# Altium schematic sheet THE_FIRST.SchDoc
size 558 x 431 mm; DocumentNumber: 1; SheetNumber: 1; SheetTotal: 9
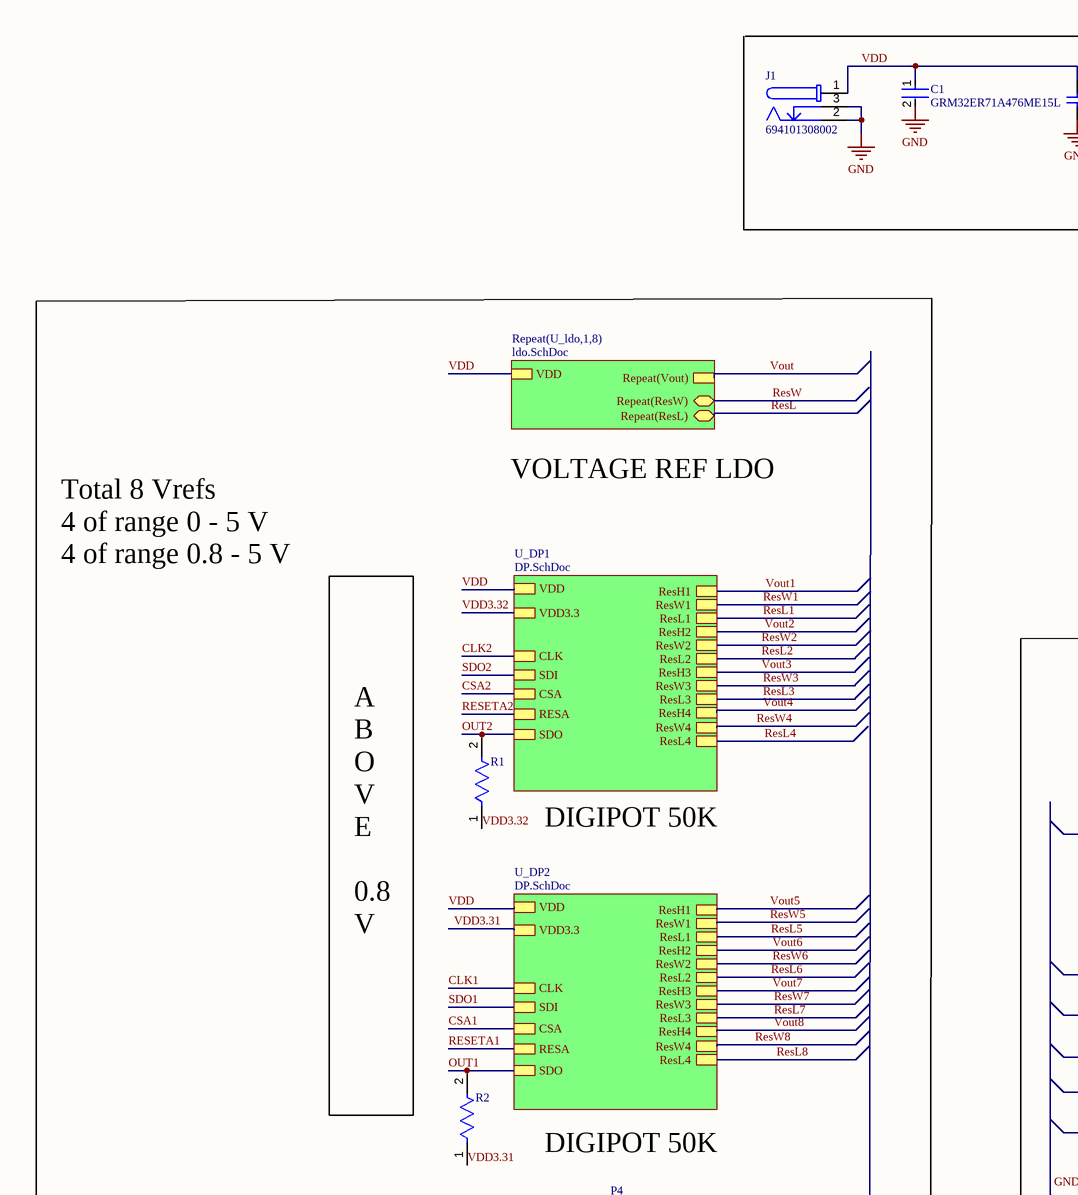
[diagram p0: THE_FIRST.SchDoc, top left]
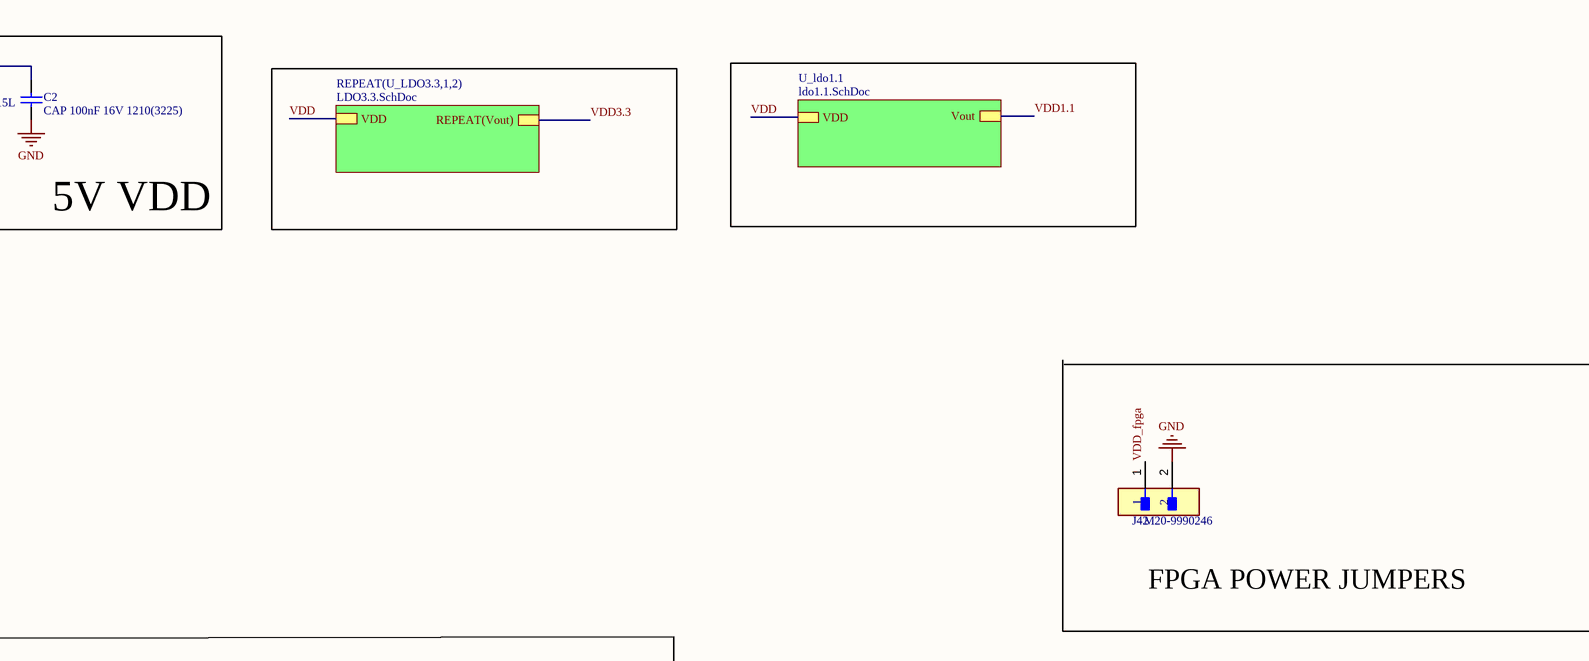
[diagram p1: THE_FIRST.SchDoc, top right]
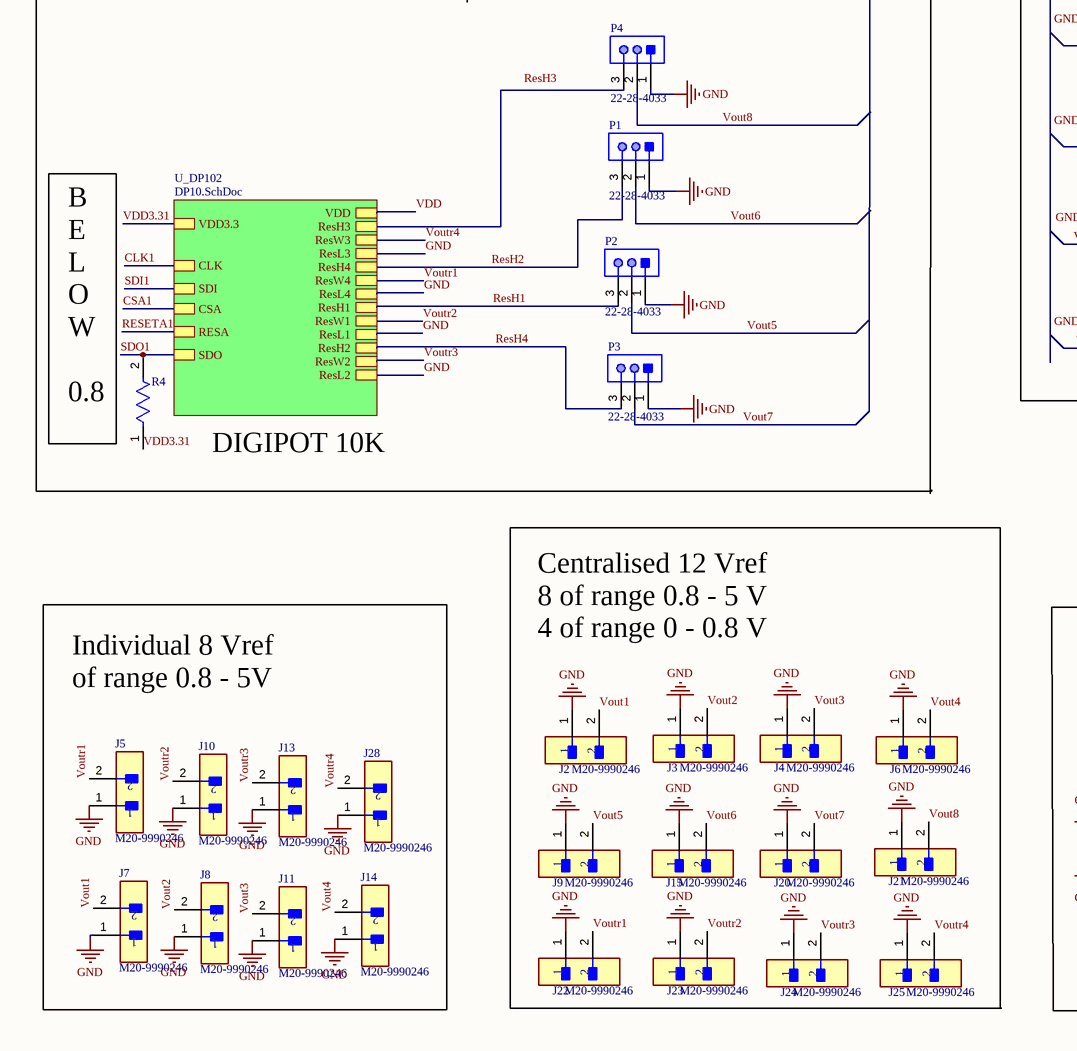
[diagram p2: THE_FIRST.SchDoc, bottom left]
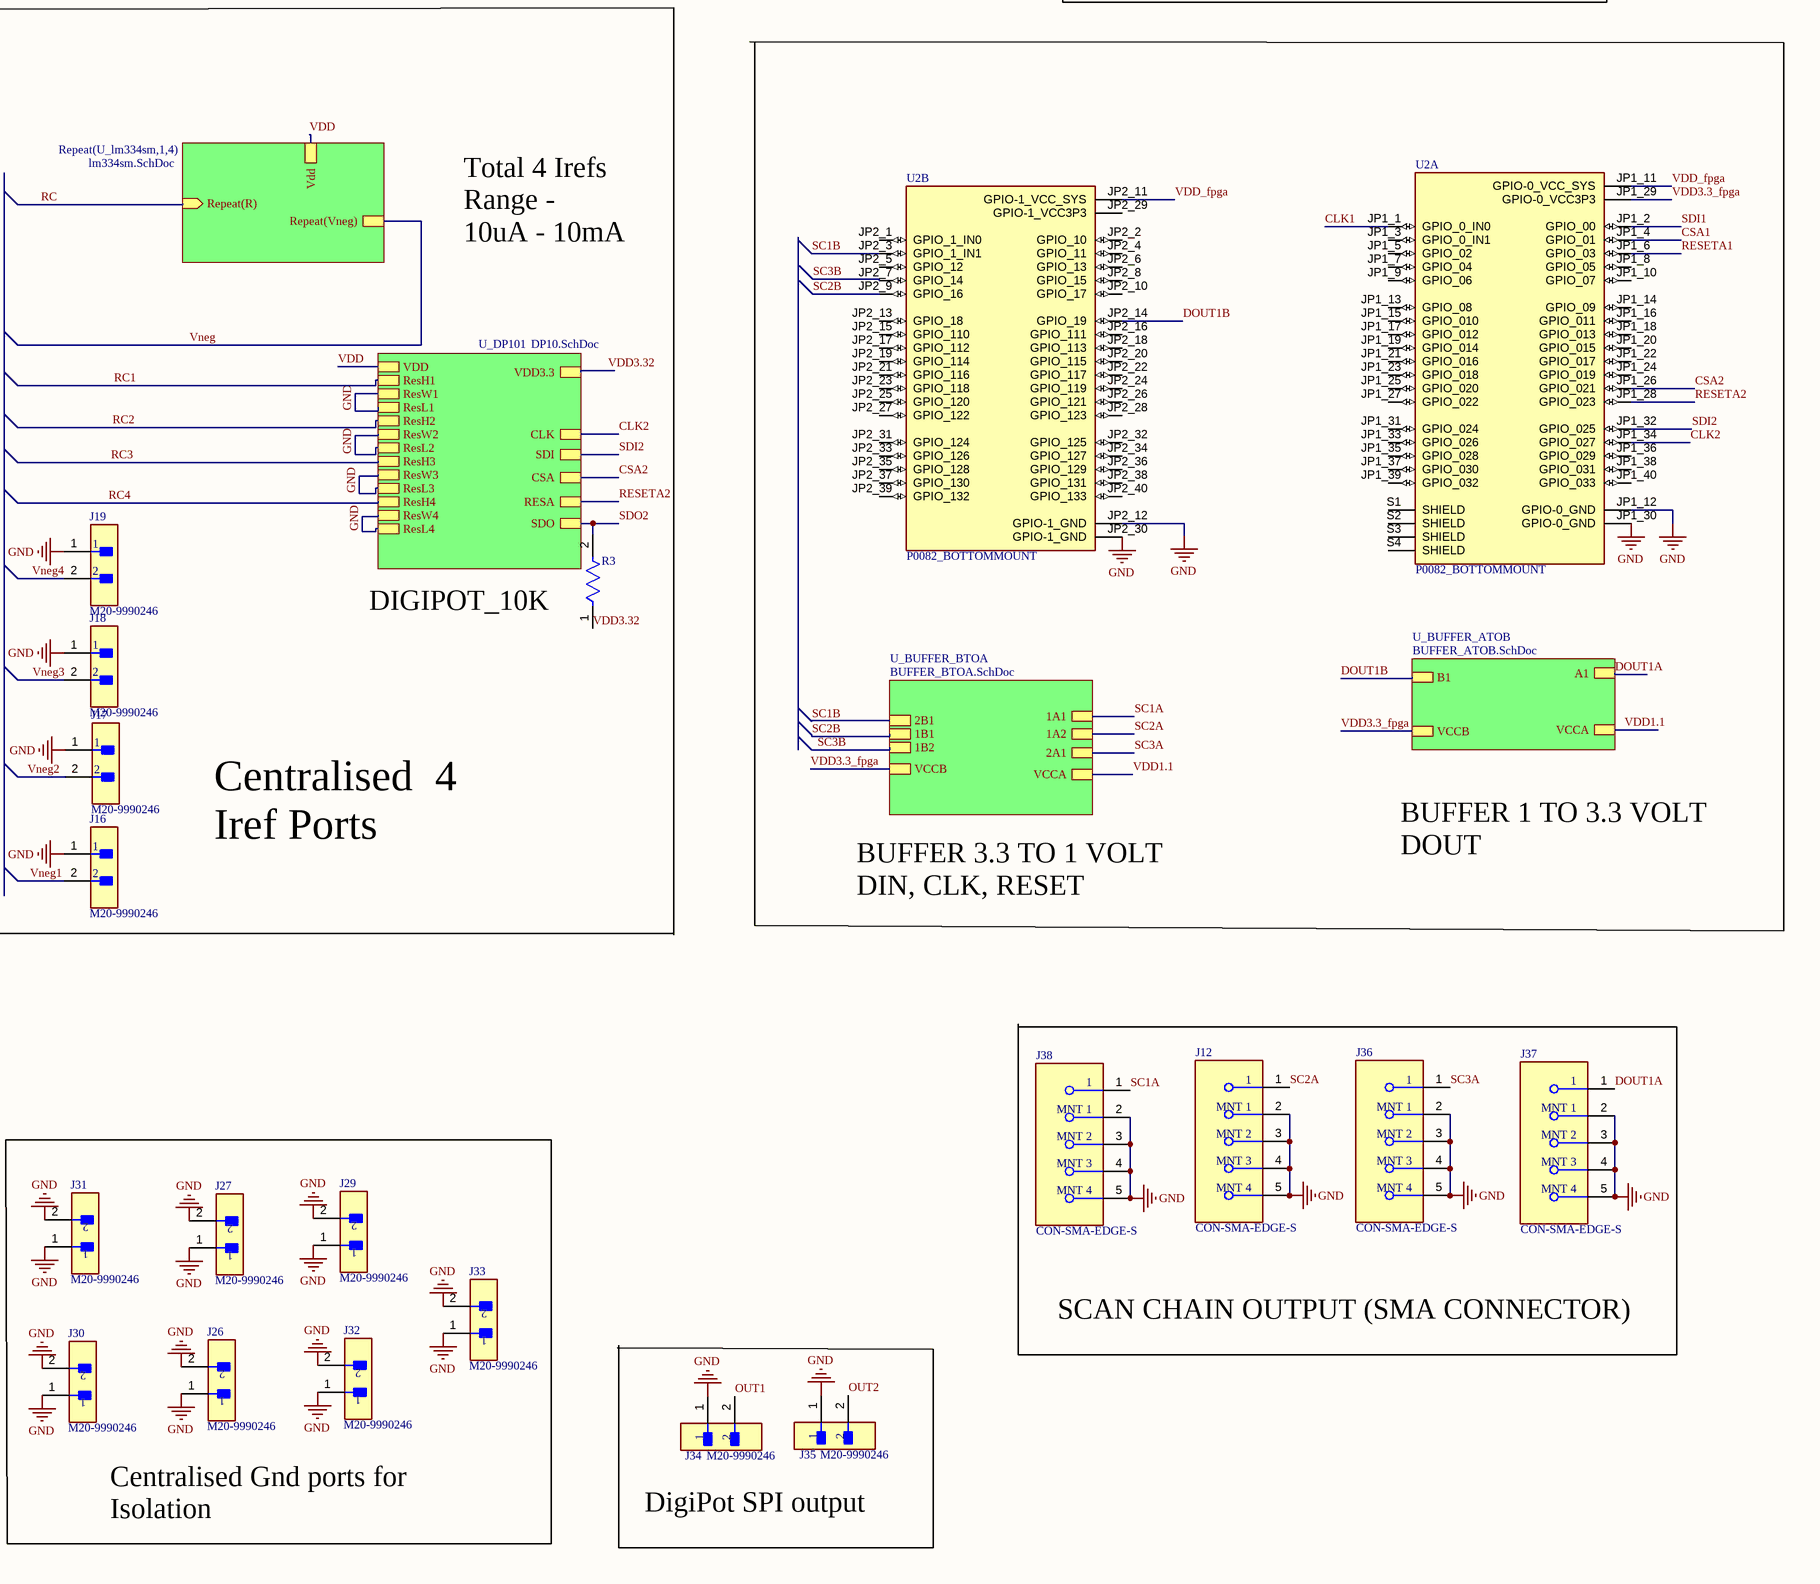
[diagram p3: THE_FIRST.SchDoc, bottom right]

## Parts
C1  GRM32ER71A476ME15L  [FP-GRM32E-0_3-0_2-IPC_A]
C2  CAP 100nF 16V 1210(3225)  [CAPC1210(3225)115_M]
J1  694101308002  [694101308002]
J2  M20-9990246  [FP-M20-9990246-MFG]
J3  M20-9990246  [FP-M20-9990246-MFG]
J4  M20-9990246  [FP-M20-9990246-MFG]
J5  M20-9990246  [FP-M20-9990246-MFG]
J6  M20-9990246  [FP-M20-9990246-MFG]
J7  M20-9990246  [FP-M20-9990246-MFG]
J8  M20-9990246  [FP-M20-9990246-MFG]
J9  M20-9990246  [FP-M20-9990246-MFG]
J10  M20-9990246  [FP-M20-9990246-MFG]
J11  M20-9990246  [FP-M20-9990246-MFG]
J12  CON-SMA-EDGE-S  [FP-CON-SMA-EDGE-S-MFG]
J13  M20-9990246  [FP-M20-9990246-MFG]
J14  M20-9990246  [FP-M20-9990246-MFG]
J15  M20-9990246  [FP-M20-9990246-MFG]
J16  M20-9990246  [FP-M20-9990246-MFG]
J17  M20-9990246  [FP-M20-9990246-MFG]
J18  M20-9990246  [FP-M20-9990246-MFG]
J19  M20-9990246  [FP-M20-9990246-MFG]
J20  M20-9990246  [FP-M20-9990246-MFG]
J21  M20-9990246  [FP-M20-9990246-MFG]
J22  M20-9990246  [FP-M20-9990246-MFG]
J23  M20-9990246  [FP-M20-9990246-MFG]
J24  M20-9990246  [FP-M20-9990246-MFG]
J25  M20-9990246  [FP-M20-9990246-MFG]
J26  M20-9990246  [FP-M20-9990246-MFG]
J27  M20-9990246  [FP-M20-9990246-MFG]
J28  M20-9990246  [FP-M20-9990246-MFG]
J29  M20-9990246  [FP-M20-9990246-MFG]
J30  M20-9990246  [FP-M20-9990246-MFG]
J31  M20-9990246  [FP-M20-9990246-MFG]
J32  M20-9990246  [FP-M20-9990246-MFG]
J33  M20-9990246  [FP-M20-9990246-MFG]
J34  M20-9990246  [FP-M20-9990246-MFG]
J35  M20-9990246  [FP-M20-9990246-MFG]
J36  CON-SMA-EDGE-S  [FP-CON-SMA-EDGE-S-MFG]
J37  CON-SMA-EDGE-S  [FP-CON-SMA-EDGE-S-MFG]
J38  CON-SMA-EDGE-S  [FP-CON-SMA-EDGE-S-MFG]
J42  M20-9990246  [FP-M20-9990246-MFG]
P1  22-28-4033  [MOLX-22-28-4033_V]
P2  22-28-4033  [MOLX-22-28-4033_V]
P3  22-28-4033  [MOLX-22-28-4033_V]
P4  22-28-4033  [MOLX-22-28-4033_V]
R1  ERA-2AEB222X  [FP-ERA2A-MFG]  (value not drawn)
R2  ERA-2AEB222X  [FP-ERA2A-MFG]  (value not drawn)
R3  ERA-2AEB222X  [FP-ERA2A-MFG]  (value not drawn)
R4  ERA-2AEB222X  [FP-ERA2A-MFG]  (value not drawn)
U2  P0082_BOTTOMMOUNT  [MODULE_P0082_BOTTOMMOUNT]  (parts A,B of 2)

## Sub-sheets
REPEAT(U_LDO3.3,1,2) = LDO3.3.SchDoc: VDD, REPEAT(Vout)
Repeat(U_ldo,1,8) = ldo.SchDoc: VDD, Repeat(Vout), Repeat(ResW) (bidir), Repeat(ResL) (bidir)
Repeat(U_lm334sm,1,4) = lm334sm.SchDoc: Vdd, Repeat(R) (in), Repeat(Vneg)
U_BUFFER_ATOB = BUFFER_ATOB.SchDoc: B1, A1, VCCA, VCCB
U_BUFFER_BTOA = BUFFER_BTOA.SchDoc: VCCA, 2B1, 1B1, 1B2, 2A1, 1A1, 1A2, VCCB
U_DP1 = DP.SchDoc: VDD, ResH1, ResW1, ResL1, ResH2, ResW2, ResL2, ResH3, ResW3, ResL3, ResH4, ResW4, ResL4, VDD3.3, CLK, SDI, CSA, RESA, SDO
U_DP2 = DP.SchDoc: VDD, ResH1, ResW1, ResL1, ResH2, ResW2, ResL2, ResH3, ResW3, ResL3, ResH4, ResW4, ResL4, VDD3.3, CLK, SDI, CSA, RESA, SDO
U_DP101 = DP10.SchDoc: VDD, ResH1, ResW1, ResL1, ResH2, ResW2, ResL2, ResH3, ResW3, ResL3, ResH4, ResW4, ResL4, VDD3.3, CLK, SDI, CSA, RESA, SDO
U_DP102 = DP10.SchDoc: VDD, ResH3, ResW3, ResL3, ResH4, ResW4, ResL4, ResH1, ResW1, ResL1, ResH2, ResW2, ResL2, VDD3.3, CLK, SDI, CSA, RESA, SDO
U_ldo1.1 = ldo1.1.SchDoc: VDD, Vout

## Nets
GND: C1.2 C2.1 J1.2 J1.3 J2.1 J3.1 J4.1 J5.1 J6.1 J7.1 J8.1 J9.1 J10.1 J11.1 J12.2(MNT_1) J12.3(MNT_2) J12.4(MNT_3) J12.5(MNT_4) J13.1 J14.1 J15.1 J16.1 J17.1 J18.1 J19.1 J20.1 J21.1 J22.1 J23.1 J24.1 J25.1 J26.1 J26.2 J27.1 J27.2 J28.1 J29.1 J29.2 J30.1 J30.2 J31.1 J31.2 J32.1 J32.2 J33.1 J33.2 J34.1 J35.1 J36.2(MNT_1) J36.3(MNT_2) J36.4(MNT_3) J36.5(MNT_4) J37.2(MNT_1) J37.3(MNT_2) J37.4(MNT_3) J37.5(MNT_4) J38.2(MNT_1) J38.3(MNT_2) J38.4(MNT_3) J38.5(MNT_4) J42.2 P1.1 P2.1 P3.1 P4.1 U2.JP1_12(GPIO-0_GND) U2.JP1_30(GPIO-0_GND) U2.JP2_12(GPIO-1_GND) U2.JP2_30(GPIO-1_GND) ; sheet U_DP101/ResW1, sheet U_DP101/ResL1, sheet U_DP101/ResW2, sheet U_DP101/ResL2, sheet U_DP101/ResW3, sheet U_DP101/ResL3, sheet U_DP101/ResW4, sheet U_DP101/ResL4, sheet U_DP102/ResL3, sheet U_DP102/ResL4, sheet U_DP102/ResL1, sheet U_DP102/ResL2
CLK1: U2.JP1_1(GPIO_0_IN0) ; sheet U_DP2/CLK, sheet U_DP102/CLK
CLK2: U2.JP1_34(GPIO_027) ; sheet U_DP1/CLK, sheet U_DP101/CLK
CSA1: U2.JP1_4(GPIO_01) ; sheet U_DP2/CSA, sheet U_DP102/CSA
CSA2: U2.JP1_26(GPIO_021) ; sheet U_DP1/CSA, sheet U_DP101/CSA
DOUT1A: J37.1 ; sheet U_BUFFER_ATOB/A1
DOUT1B: U2.JP2_14(GPIO_19) ; sheet U_BUFFER_ATOB/B1
OUT1: J34.2 R2.2 ; sheet U_DP2/SDO
OUT2: J35.2 R1.2 ; sheet U_DP1/SDO
RC: sheet Repeat(U_lm334sm,1,4)/Repeat(R)
RC1: sheet U_DP101/ResH1
RC2: sheet U_DP101/ResH2
RC3: sheet U_DP101/ResH3
RC4: sheet U_DP101/ResH4
RESETA1: U2.JP1_6(GPIO_03) ; sheet U_DP2/RESA, sheet U_DP102/RESA
RESETA2: U2.JP1_28(GPIO_023) ; sheet U_DP1/RESA, sheet U_DP101/RESA
ResH1: P2.3 ; sheet U_DP102/ResH1
ResH2: P1.3 ; sheet U_DP102/ResH4
ResH4: P3.3 ; sheet U_DP102/ResH2
ResL: sheet Repeat(U_ldo,1,8)/Repeat(ResL)
ResL1: sheet U_DP1/ResL1
ResL2: sheet U_DP1/ResL2
ResL3: sheet U_DP1/ResL3
ResL4: sheet U_DP1/ResL4
ResL5: sheet U_DP2/ResL1
ResL6: sheet U_DP2/ResL2
ResL7: sheet U_DP2/ResL3
ResL8: sheet U_DP2/ResL4
ResW: sheet Repeat(U_ldo,1,8)/Repeat(ResW)
ResW1: sheet U_DP1/ResW1
ResW2: sheet U_DP1/ResW2
ResW3: sheet U_DP1/ResW3
ResW4: sheet U_DP1/ResW4
ResW5: sheet U_DP2/ResW1
ResW6: sheet U_DP2/ResW2
ResW7: sheet U_DP2/ResW3
ResW8: sheet U_DP2/ResW4
SC1A: J38.1 ; sheet U_BUFFER_BTOA/1A1
SC1B: U2.JP2_3(GPIO_1_IN1) ; sheet U_BUFFER_BTOA/2B1
SC2A: J12.1 ; sheet U_BUFFER_BTOA/1A2
SC2B: U2.JP2_9(GPIO_16) ; sheet U_BUFFER_BTOA/1B1
SC3A: J36.1 ; sheet U_BUFFER_BTOA/2A1
SC3B: U2.JP2_7(GPIO_14) ; sheet U_BUFFER_BTOA/1B2
SDI1: U2.JP1_2(GPIO_00) ; sheet U_DP102/SDI
SDI2: U2.JP1_32(GPIO_025) ; sheet U_DP101/SDI
SDO1: R4.2 ; sheet U_DP2/SDI, sheet U_DP102/SDO
SDO2: R3.2 ; sheet U_DP1/SDI, sheet U_DP101/SDO
VDD: C1.1 C2.2 J1.1 ; sheet Repeat(U_ldo,1,8)/VDD, sheet U_DP1/VDD, sheet U_DP2/VDD, sheet Repeat(U_lm334sm,1,4)/Vdd, sheet U_DP101/VDD, sheet U_DP102/VDD, sheet REPEAT(U_LDO3.3,1,2)/VDD, sheet U_ldo1.1/VDD
VDD1.1: sheet U_ldo1.1/Vout, sheet U_BUFFER_ATOB/VCCA, sheet U_BUFFER_BTOA/VCCA
VDD3.3: sheet REPEAT(U_LDO3.3,1,2)/REPEAT(Vout)
VDD3.3_fpga: U2.JP1_29(GPIO-0_VCC3P3) ; sheet U_BUFFER_ATOB/VCCB, sheet U_BUFFER_BTOA/VCCB
VDD3.31: R2.1 R4.1 ; sheet U_DP2/VDD3.3, sheet U_DP102/VDD3.3
VDD3.32: R1.1 R3.1 ; sheet U_DP1/VDD3.3, sheet U_DP101/VDD3.3
VDD_fpga: J42.1 U2.JP1_11(GPIO-0_VCC_SYS) U2.JP2_11(GPIO-1_VCC_SYS)
Vneg: sheet Repeat(U_lm334sm,1,4)/Repeat(Vneg)
Vneg1: J16.2
Vneg2: J17.2
Vneg3: J18.2
Vneg4: J19.2
Vout: sheet Repeat(U_ldo,1,8)/Repeat(Vout)
Vout1: J2.2 J7.2 ; sheet U_DP1/ResH1
Vout2: J3.2 J8.2 ; sheet U_DP1/ResH2
Vout3: J4.2 J11.2 ; sheet U_DP1/ResH3
Vout4: J6.2 J14.2 ; sheet U_DP1/ResH4
Vout5: J9.2 P2.2 ; sheet U_DP2/ResH1
Vout6: J15.2 P1.2 ; sheet U_DP2/ResH2
Vout7: J20.2 P3.2 ; sheet U_DP2/ResH3
Vout8: J21.2 P4.2 ; sheet U_DP2/ResH4
Voutr1: J5.2 J22.2 ; sheet U_DP102/ResW4
Voutr2: J10.2 J23.2 ; sheet U_DP102/ResW1
Voutr3: J13.2 J24.2 ; sheet U_DP102/ResW2
Voutr4: J25.2 J28.2 ; sheet U_DP102/ResW3
NetP4_3: P4.3 ; sheet U_DP102/ResH3

Not connected (* = marked no-connect by the designer): U2 JP1_3(GPIO_0_IN1) JP1_5(GPIO_02) JP1_7(GPIO_04) JP1_8(GPIO_05) JP1_9(GPIO_06) JP1_10(GPIO_07) JP1_13(GPIO_08) JP1_14(GPIO_09) JP1_15(GPIO_010) JP1_16(GPIO_011) JP1_17(GPIO_012) JP1_18(GPIO_013) JP1_19(GPIO_014) JP1_20(GPIO_015) JP1_21(GPIO_016) JP1_22(GPIO_017) JP1_23(GPIO_018) JP1_24(GPIO_019) JP1_25(GPIO_020) JP1_27(GPIO_022) JP1_31(GPIO_024) JP1_33(GPIO_026) JP1_35(GPIO_028) JP1_36(GPIO_029) JP1_37(GPIO_030) JP1_38(GPIO_031) JP1_39(GPIO_032) JP1_40(GPIO_033) JP2_1(GPIO_1_IN0) JP2_2(GPIO_10) JP2_4(GPIO_11) JP2_5(GPIO_12) JP2_6(GPIO_13) JP2_8(GPIO_15) JP2_10(GPIO_17) JP2_13(GPIO_18) JP2_15(GPIO_110) JP2_16(GPIO_111) JP2_17(GPIO_112) JP2_18(GPIO_113) JP2_19(GPIO_114) JP2_20(GPIO_115) JP2_21(GPIO_116) JP2_22(GPIO_117) JP2_23(GPIO_118) JP2_24(GPIO_119) JP2_25(GPIO_120) JP2_26(GPIO_121) JP2_27(GPIO_122) JP2_28(GPIO_123) JP2_29(GPIO-1_VCC3P3) JP2_31(GPIO_124) JP2_32(GPIO_125) JP2_33(GPIO_126) JP2_34(GPIO_127) JP2_35(GPIO_128) JP2_36(GPIO_129) JP2_37(GPIO_130) JP2_38(GPIO_131) JP2_39(GPIO_132) JP2_40(GPIO_133) S1(SHIELD) S2(SHIELD) S3(SHIELD) S4(SHIELD)

## Notes on the sheet
- 5V VDD
- 3.3V VDD
- 1.1V VDD
- V Refs
- VOLTAGE REF LDO
- Total 8 Vrefs
  4 of range 0 - 5 V
  4 of range 0.8 - 5 V
- FPGA POWER JUMPERS
- CURRENT Refs
- FPGA BOARD
- DIGIPOT 50K
- Total 4 Irefs
  Range -
  10uA - 10mA
- A
  B
  O
  V
  E
  0.8
  V
- (near R3) DIGIPOT_10K
- Centralised  4
  Iref Ports
- BUFFER 3.3 TO 1 VOLT
  DIN, CLK, RESET
- BUFFER 1 TO 3.3 VOLT
  DOUT
- (near R4) B
  E
  L
  O
  W
  0.8
  V
- DIGIPOT 10K
- Centralised 12 Vref
  8 of range 0.8 - 5 V
  4 of range 0 - 0.8 V
- Individual 8 Vref
  of range 0.8 - 5V
- SCAN CHAIN OUTPUT (SMA CONNECTOR)
- Centralised Gnd ports for Isolation
- DigiPot SPI output
- Labels drawn without touching a wire or pin: ResH3
- DWG. NO.
- REV.
- SHT.
- REVISION
- DESCRIPTION
- DATE
- APPROVED
- THIS DOCUMENT AND THE DATA DISCLOSED HEREIN OR HEREWITH IS THE PROPERTY OF ALTIUM LIMITED AND MAY BE FREELY DISTRIBUTED IN WHOLE. NO RIGHTS ARE RESERVED OR EXPRESS OR IMPLIED WARANTEE GIVEN.
- ENG:
- DSN:
- APPROVALS
- PROJECT
- DOCUMENT REVISION:
- DESIGN ITEM:
- CHK:
- BOM:
- REFERENCE DOCUMENTS
- PROJECT REVISION:
- TITLE
- FAB DWG:
- PCB DWG:
- ASSY DWG:
- SCALE:
- SIZE
- C
- CAGE CODE
- FILE NAME
- DWG NO.
- SHEET
- OF
- REV

## Library data of the parts
C1 = CMP-2000-06363-3: Chip Multilayer Ceramic Capacitors for General Purpose, 1210, 47uF, X7R, 15%, 20%, 10V; Voltage Rating (DC): 10V; Lead Free: Lead Free; Capacitance: 47uF; Max Operating Temperature: 125°C; Height: 2.5mm; Min Operating Temperature: -55°C; Length: 3.2mm; Package Quantity: 1; Termination: SMD/SMT; Case Code (Imperial): 1210; Width: 0.098inch; Voltage Rating: 10V; Thickness: 0.106inch; Depth: 2.5mm; REACH SVHC: No SVHC; Packaging: Tape and Reel; Dielectric: X7R; Voltage: 10V; Radiation Hardening: No; Case Code (Metric): 3225; Tolerance: 20%; Case/Package: 1210; Mount: Surface Mount
C2 = CMP-1038-01632-1: CAP 100nF 16V ±1% 1210 (3225 Metric) Thickness 1.1mm SMD; Manufacturer: Panasonic; Manufacturer Part Number: ECH-U1C104GX5; Case-Metric: 3225; Tolerance: Â±1%; Case-EIA: 1210; Dielectric Material: Polyphenylene; Capacitor Type: FILM; Tolerance  (fill in as +-): 2%; Value: 100nF; Technology: SMT; Max Thickness: 1.1 mm; Rated Voltage: 16 V; Supplier: Digikey; Supplier Part Number: PCF1189CT-ND; RoHS: Yes; Category: Film Capacitors; Stock: 18597; Pricing: 1=1, 10=0.637, 50=0.4958, 100=0.4521, 500=0.37836, 1000=0.35557 (USD); Mounting Technology: Surface Mount; Pins: 2; Case/Package: 1210; Package Shape: Rectangular; Terminal Finish: Copper; Min Operating Temperature: -55°C; Max Operating Temperature: 125°C; Package Style: SMTMeter; Packaging: Tape and Reel; Tolerance (fill in as +-): 2%; Rated DC Voltage (URdc): 16V; JESD-609 Code: e1; Termination: Wraparound; Length: 3.2mm; Width: 2.5mm; Height: 2.1mm; Reach SVHC Compliant: Yes; RoHS Compliant: Yes; ComponentLink1URL: https://datasheet.ciiva.com:443/pdfs/VipMasterIC/IC/PANA/PANA-S-A0009590914/PANA-S-A0009590914-1.pdf?src-supplier=IHS+Markit; ComponentLink1Description: https://datasheet.ciiva.com:443/pdfs/VipMasterIC/IC/PANA/PANA-S-A0009590914/PANA-S-A0009590914-1.pdf?src-supplier=IHS+Markit; ComponentLink2URL: https://datasheet.ciiva.com/11792/0900766b8016ecc7-11792269.pdf?src-supplier=Rs; ComponentLink2Description: https://datasheet.ciiva.com/11792/0900766b8016ecc7-11792269.pdf?src-supplier=Rs; ComponentLink3URL: https://datasheet.ciiva.com/11416/abd0000ce13-11416261.pdf?src-supplier=Avnet; ComponentLink3Description: https://datasheet.ciiva.com/11416/abd0000ce13-11416261.pdf?src-supplier=Avnet; ComponentLink4URL: https://datasheet.ciiva.com/30113/21abd0000ce13-30113725.pdf?src-supplier=Onlinecomponents.com; ComponentLink4Description: https://datasheet.ciiva.com/30113/21abd0000ce13-30113725.pdf?src-supplier=Onlinecomponents.com; ComponentLink5URL: https://datasheet.ciiva.com/14606/70067901-14606805.pdf?src-supplier=Allied+Electronics; ComponentLink5Description: https://datasheet.ciiva.com/14606/70067901-14606805.pdf?src-supplier=Allied+Electronics; ComponentLink6URL: https://datasheet.ciiva.com/27055/1981672-27055573.pdf?src-supplier=Jameco; ComponentLink6Description: https://datasheet.ciiva.com/27055/1981672-27055573.pdf?src-supplier=Jameco
J1 = CMP-1502-00182-2: NexarPartId: 52676095; Voltage Rating: 12V; Connector Type: Power; Gender: Male; Insulation Resistance: 100MΩ; Current Rating: 2A; Shielding: Unshielded; Max Operating Temperature: 85°C; Housing Material: Polyamide; RoHS: Compliant; Color: Black; Voltage Rating (DC): 12V; Contact Plating: Tin; Min Operating Temperature: -20°C; Operating Supply Voltage: 12V; REACH SVHC: Unknown; Mount: Through Hole; Termination: Through Hole; Flammability Rating: UL94 V-0; Contact Gender: Male; Packaging: Bulk
J2-J11 J13-J35 J42 = CMP-15831-000009-1: CONN HEADER VERT 2POS 2.54MM; Manufacturer: Harwin; Conn Gender: Male; Conn Orientation: Vertical; Number Of Contacts: 2; Current Rating: 3A; ComponentLink2URL: https://cdn.harwin.com/pdfs/M20-999.pdf; ComponentLink2Description: Datasheet; Package: M20-9990246; Temperature: -40°C to +105°C; Octopart: https://octopart.com/m20-9990246-harwin-2590635; Mouser Description: 2.54mm (0.1") Pitch SIL Vertical PC Tail Pin Header, 6.1mm mating pin height, tin, 2 contacts; Temperature Range High: +105°C; Device Class L1: Connectors; RoHS: TRUE; Automotive: No; Height: 8.99mm; Number Of Rows: 1; Contact Material: Tin,Nickel; Category: Conn; Pitch: 2.54mm; Lead Free: Yes; Digikey Description: CONN HEADER VERT 2POS 2.54MM; Manufacturer Part Number: M20-9990246; Temperature Range Low: -40°C; Device Class L3: unset; Device Class L2: Headers and Wire Housings
J12 J36-J38 = CMP-204357-000001-1: CONN SMA JACK STR EDGE MNT; Manufacturer: RF Solutions Ltd.; Impedance: 50Ω; Conn Orientation: Right Angle; Is Female: yes; Number Of Contacts: 1; Frequency: 18GHz; Shielding: true; Category: Conn; ComponentLink2URL: https://www.rfsolutions.co.uk/downloads/1498648656DS-CON-EDGE-SMA-4.pdf; Octopart: https://octopart.com/con-sma-edge-s-rf+solutions-70967450; Package: CONN_JACK; Manufacturer Part Number: CON-SMA-EDGE-S; Height: 6.35mm; Device Class L1: Connectors; Footprint Url: https://forum.upverter.com/uploads/default/original/3X/b/e/be75b907af57498775929d6d9099689c472e0307.pdf; Contact Material: Gold; ComponentLink2Description: Datasheet; Device Class L2: RF / Coaxial Connectors; RoHS: TRUE; Device Class L3: unset; Digikey Description: CONN SMA JACK STR EDGE MNT; Lead Free: Yes; Automotive: No; Supplier: Mouser; Supplier Part Number: 223-CON-SMA-EDGE-S; Stock: 609; Pricing: 1=2.52, 10=2.14, 50=1.91, 100=1.82, 1000=1.54, 10000=1.45 (USD); ComponentLink1URL: https://media.digikey.com/pdf/Data%20Sheets/RF%20Solutions%20PDFs/CON-SMA-EDGE.pdf?src-supplier=Digikey; ComponentLink1Description: https://media.digikey.com/pdf/Data%20Sheets/RF%20Solutions%20PDFs/CON-SMA-EDGE.pdf?src-supplier=Digikey; ComponentLink3URL: https://datasheet.octopart.com/CON-SMA-EDGE-S-RF-Solutions-datasheet-153593425.pdf?src-supplier=Element14; ComponentLink3Description: https://datasheet.octopart.com/CON-SMA-EDGE-S-RF-Solutions-datasheet-153593425.pdf?src-supplier=Element14
P1-P4 = CMP-1676-00001-5: Male Header, Pitch 2.54 mm, 1 x 3 Position, Height 8.38 mm, Tail Length 3.18 mm, RoHS, Bulk; Manufacturer: Molex; Rows: 1; Voltage Rating: 250 V; Current Rating: 4 A; Min Operating Temperature: 0 degC; Lead Pitch: 0.1 inch; Packaging: Bulk; Contact Finish: Gold; RoHSCompliant: true; Contact Material: Brass; PackageReference: 22-28-4033; REACH SVHC: Unknown; PackageDescription: Male Header, Pitch 2.54 mm, 1 x 3 Position, Height 8.38 mm, Tail Length 3.18 mm; ComponentLink2URL: http://www.molex.com/pdm_docs/sd/022284033_sd.pdf; Height: 8.38 mm; Mounting Technology: Through Hole; ComponentLink1Description: Manufacturer URL; Length: 7.62 mm; Mount: Through Hole; DatasheetVersion: Rev. G, 01/2012; Max Operating Temperature: 75 degC; ComponentLink2Description: Datasheet; Colour: Black; Pins: 3; Contact Plating: Gold; Package Quantity: 1; ComponentLink1URL: http://www.molex.com/
R1-R4 = CMP-2002-05881-2: RES SMD 2.2K OHM 0.1% 1/16W 0402; Manufacturer: Panasonic; Temperature Coefficient: 25ppm/°C; Power Rating: 0.063W; Value: 2.2kΩ; Voltage Rating: 50V; Automotive Grade: Grade 0; Automotive: Yes; Device Class L1: Passive Components; Tolerance: 0.1%; Digikey Description: RES SMD 2.2K OHM 0.1% 1/16W 0402; Device Class L2: Resistors; Manufacturer Part Number: ERA-2AEB222X; Octopart: https://octopart.com/era-2aeb222x-panasonic-9251391; ComponentLink2Description: Datasheet; Ipc Land Pattern Name: RESC10050X35; Package: ERA2A; Height: 0.4mm; ComponentLink2URL: https://industrial.panasonic.com/cdbs/www-data/pdf/RDM0000/AOA0000C307.pdf; Temperature Range High: +155°C; Device Class L3: Chip SMD Resistors; Temperature Range Low: -55°C; Lead Free: Yes; Mouser Description: Thin Film Resistors - SMD 0402 1/16W 2.2Kohms; Footprint Url: https://b2b-api.panasonic.eu/file_stream/pids/fileversion/1079; Temperature: -55°C to +155°C; Category: Res; Resistance: 2.2kΩ; Composition: Metal Film; Series: E24; RoHS: TRUE
U2 = P0082_BOTTOMMOUNT: Cyclone IV E FPGA DE0-Nano EP4CE22 CycloneÂ® IV E FPGA Evaluation Board; MF: Terasic Inc.; MP: P0082; SnapEDA_Link: https://www.snapeda.com/parts/P0082/Terasic+Inc./view-part/?ref=snap; Package: None; Value: *; Check_prices: https://www.snapeda.com/parts/P0082/Terasic+Inc./view-part/?ref=eda